# EAGLE design untitled (EAGLE 6.1)
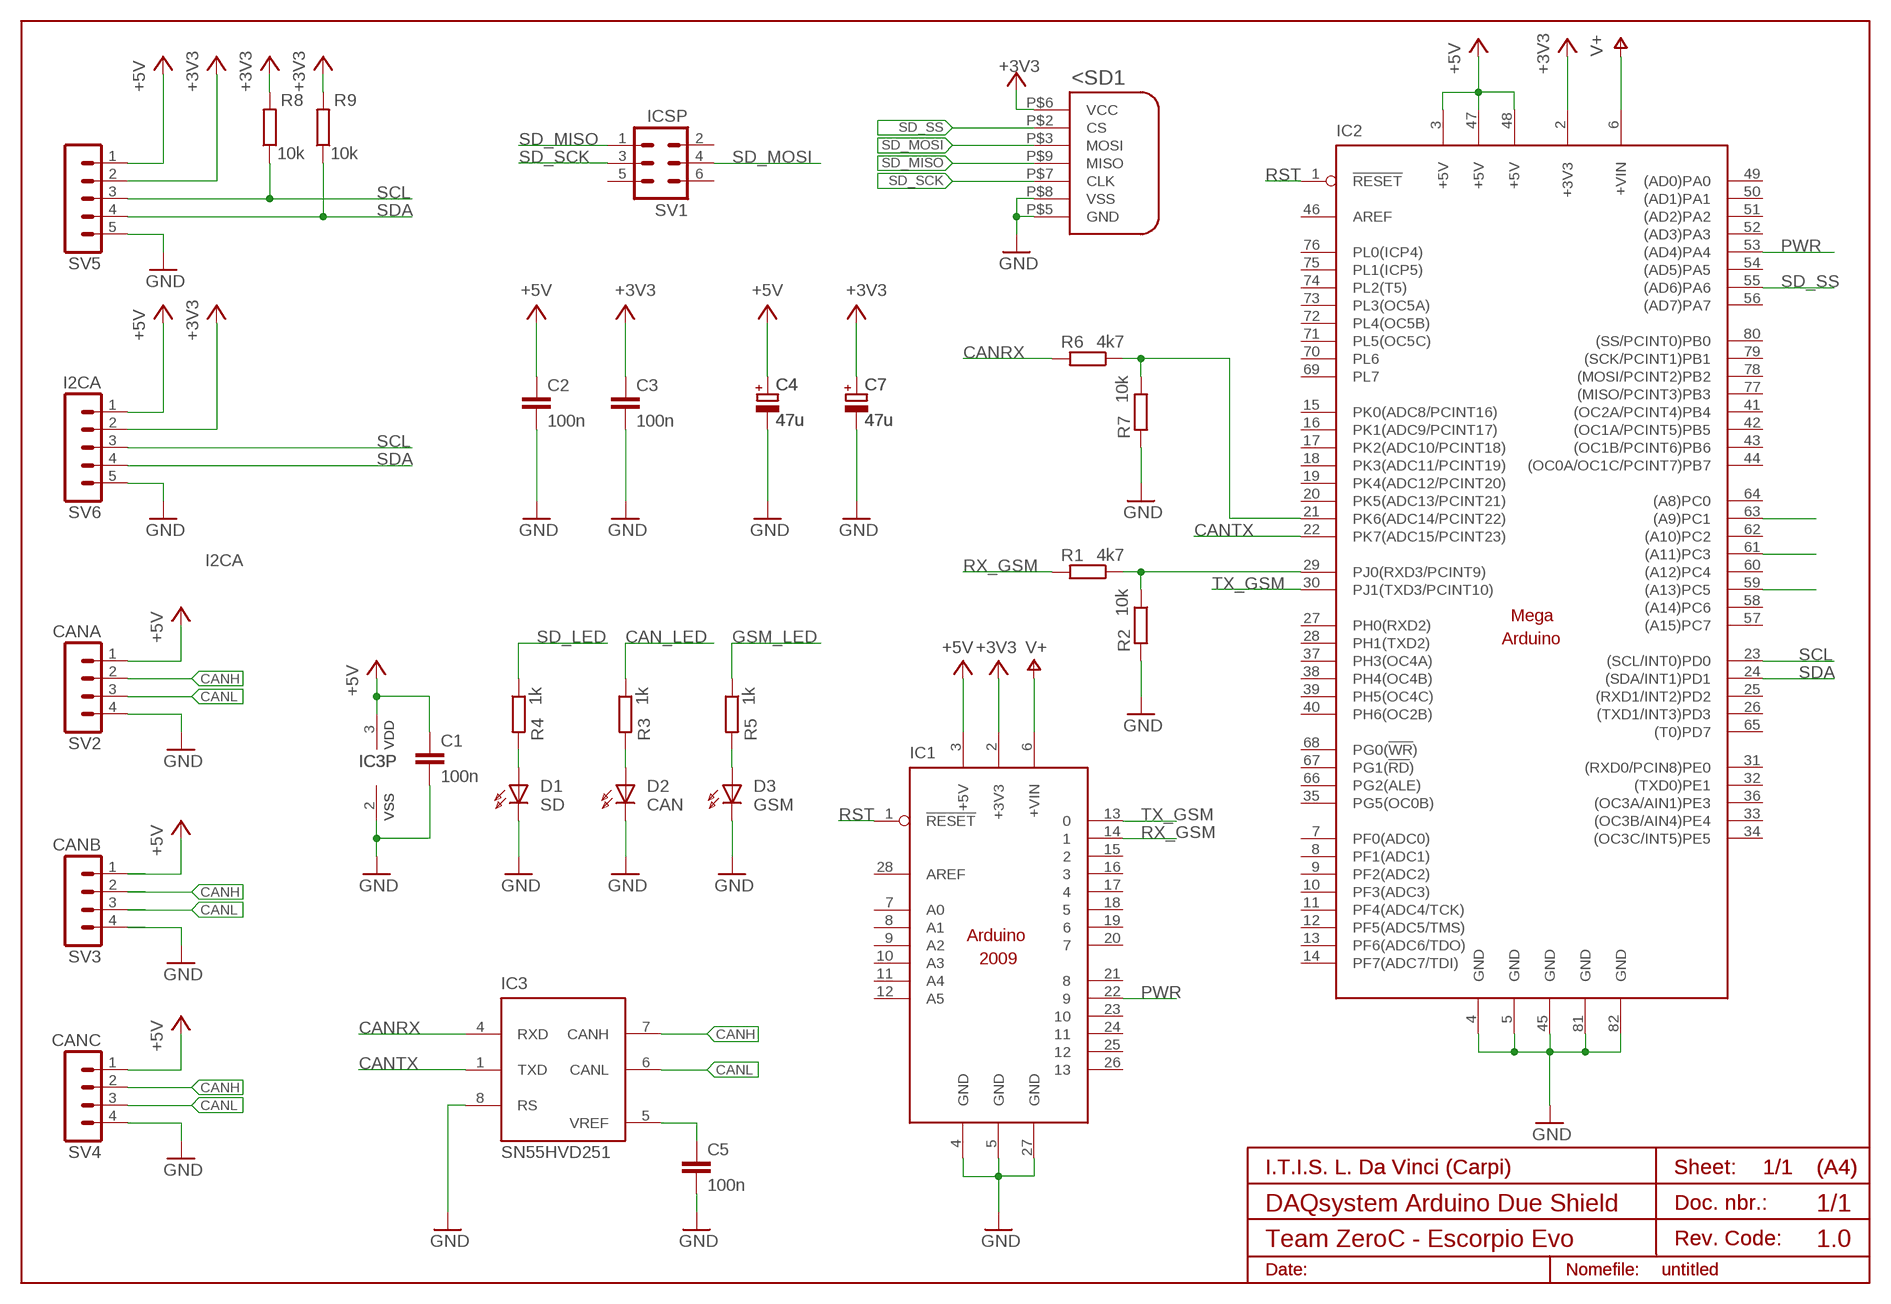
[diagram p0: schematic, sheet 1]

## Parts
C1  100n  C-EUC3225  [C3225]
C2  100n  C-EUC3225  [C3225]
C3  100n  C-EUC3225  [C3225]
C4  47u  C_POL_01  [E-01]
C5  100n  C-EUC3225  [C3225]
C7  47u  C_POL_01  [E-01]
D1  SD  LED5MM  [LED5MM]
D2  CAN  LED5MM  [LED5MM]
D3  GSM  LED5MM  [LED5MM]
IC1  ARDUINO2009_10  [ARDUINO2009]
IC2  MEGAARDUINO_1  [MEGA_ARDUINO]
IC3  SN55HVD251  [DIL8]
R1  4k7  R-EU_M1206  [M1206]
R2  10k  R-EU_M1206  [M1206]
R3  1k  R-EU_M1206  [M1206]
R4  1k  R-EU_M1206  [M1206]
R5  1k  R-EU_M1206  [M1206]
R6  4k7  R-EU_M1206  [M1206]
R7  10k  R-EU_M1206  [M1206]
R8  10k  R-EU_M1206  [M1206]
R9  10k  R-EU_M1206  [M1206]
SV1  ICSP  MA03-2  [MA03-2]
SV2  CANA  MA04-1  [MA04-1]
SV3  CANB  MA04-1  [MA04-1]
SV4  CANC  MA04-1  [MA04-1]
SV5  I2CA  MA05-1  [MA05-1]
SV6  I2CA  MA05-1  [MA05-1]
U$2  SD_CARD  [SD]

## Nets
+3V3: C3.1 C7.+ IC1.2(+3V3) IC2.2(+3V3) R8.2 R9.2 SV5.2 SV6.2 U$2.P$6(VCC)
+5V: C1.1 C2.1 C4.+ IC1.3(+5V) IC2.3(+5V) IC2.47(+5V) IC2.48(+5V) IC3.3(VDD) SV2.1 SV3.1 SV4.1 SV5.1 SV6.1
CAN_LED: IC2.63((A9)PC1) R3.1
CANH: IC3.7(CANH) SV2.2 SV3.2 SV4.2
CANL: IC3.6(CANL) SV2.3 SV3.3 SV4.3
CANRX: IC3.4(RXD) R6.2
CANTX: IC2.22(PK7(ADC15/PCINT23)) IC3.1(TXD)
GND: C1.2 C2.2 C3.2 C4.- C5.2 C7.- D1.K(C) D2.K(C) D3.K(C) IC1.4(GND) IC1.5(GND) IC1.27(GND) IC2.4(GND) IC2.5(GND) IC2.45(GND) IC2.81(GND) IC2.82(GND) IC3.2(VSS) IC3.8(RS) R2.2 R7.2 SV2.4 SV3.4 SV4.4 SV5.5 SV6.5 U$2.P$5(GND) U$2.P$8(VSS)
GSM_LED: IC2.61((A11)PC3) R5.1
N$1: IC2.21(PK6(ADC14/PCINT22)) R6.1 R7.1
N$4: IC2.29(PJ0(RXD3/PCINT9)) R1.1 R2.1
N$7: D2.A R3.2
N$9: D3.A R5.2
N$10: C5.1 IC3.5(VREF)
N$18: D1.A R4.2
PWR: IC1.22 IC2.53((AD4)PA4)
RST: IC1.1(!RESET) IC2.1(!RESET)
RX_GSM: IC1.14 R1.2
SCL: IC2.23((SCL/INT0)PD0) R8.1 SV5.3 SV6.3
SD_LED: IC2.59((A13)PC5) R4.1
SD_MISO: SV1.1 U$2.P$9(MISO)
SD_MOSI: SV1.4 U$2.P$3(MOSI)
SD_SCK: SV1.3 U$2.P$7(CLK)
SD_SS: IC2.55((AD6)PA6) U$2.P$2(CS)
SDA: IC2.24((SDA/INT1)PD1) R9.1 SV5.4 SV6.4
TX_GSM: IC1.13 IC2.30(PJ1(TXD3/PCINT10))
V+: IC1.6(+VIN) IC2.6(+VIN)
Unconnected: IC1.7(A0) IC1.8(A1) IC1.9(A2) IC1.10(A3) IC1.11(A4) IC1.12(A5) IC1.15 IC1.16 IC1.17 IC1.18 IC1.19 IC1.20 IC1.21 IC1.23 IC1.24 IC1.25 IC1.26 IC1.28(AREF) IC2.7(PF0(ADC0)) IC2.8(PF1(ADC1)) IC2.9(PF2(ADC2)) IC2.10(PF3(ADC3)) IC2.11(PF4(ADC4/TCK)) IC2.12(PF5(ADC5/TMS)) IC2.13(PF6(ADC6/TDO)) IC2.14(PF7(ADC7/TDI)) IC2.15(PK0(ADC8/PCINT16)) IC2.16(PK1(ADC9/PCINT17)) IC2.17(PK2(ADC10/PCINT18)) IC2.18(PK3(ADC11/PCINT19)) IC2.19(PK4(ADC12/PCINT20)) IC2.20(PK5(ADC13/PCINT21)) IC2.25((RXD1/INT2)PD2) IC2.26((TXD1/INT3)PD3) IC2.27(PH0(RXD2)) IC2.28(PH1(TXD2)) IC2.31((RXD0/PCIN8)PE0) IC2.32((TXD0)PE1) IC2.33((OC3B/AIN4)PE4) IC2.34((OC3C/INT5)PE5) IC2.35(PG5(OC0B)) IC2.36((OC3A/AIN1)PE3) IC2.37(PH3(OC4A)) IC2.38(PH4(OC4B)) IC2.39(PH5(OC4C)) IC2.40(PH6(OC2B)) IC2.41((OC2A/PCINT4)PB4) IC2.42((OC1A/PCINT5)PB5) IC2.43((OC1B/PCINT6)PB6) IC2.44((OC0A/OC1C/PCINT7)PB7) IC2.46(AREF) IC2.49((AD0)PA0) IC2.50((AD1)PA1) IC2.51((AD2)PA2) IC2.52((AD3)PA3) IC2.54((AD5)PA5) IC2.56((AD7)PA7) IC2.57((A15)PC7) IC2.58((A14)PC6) IC2.60((A12)PC4) IC2.62((A10)PC2) IC2.64((A8)PC0) IC2.65((T0)PD7) IC2.66(PG2(ALE)) IC2.67(PG1(!RD!)) IC2.68(PG0(!WR!)) IC2.69(PL7) IC2.70(PL6) IC2.71(PL5(OC5C)) IC2.72(PL4(OC5B)) IC2.73(PL3(OC5A)) IC2.74(PL2(T5)) IC2.75(PL1(ICP5)) IC2.76(PL0(ICP4)) IC2.77((MISO/PCINT3)PB3) IC2.78((MOSI/PCINT2)PB2) IC2.79((SCK/PCINT1)PB1) IC2.80((SS/PCINT0)PB0) SV1.2 SV1.5 SV1.6

## Notes on the sheet
- DAQsystem Arduino Due Shield | 1/1
- Team ZeroC - Escorpio Evo | 1.0

## Library data of the parts
C1-C3 C5 = rcl:C-EU: CAPACITOR, European symbol
C4 C7 = ITIVINCI:C_POL: condensatore elettrolitico
D1-D3 = ITIVINCI:LED5MM: LED 5 mm, round
IC1 = arduino:ARDUINO2009_1: The Arduino Duemilanove ("2009") is a microcontroller board based on the ATmega168 or ATmega328. - 14 digital input/output pins (of which 6 can be used as PWM outputs) - 6 analog inputs, a 16 MHz crystal oscillator - USB connection - power jack - ISP header - reset button It contains everything needed to support the microcontroller; simply connect it to a computer with a USB cable or power it with a AC-to-DC adapter or battery to get started http://arduino.cc/en/Main/ArduinoBoardDuemilanove
IC2 = arduino:MEGAARDUINO_1: The Arduino Mega is a microcontroller board based on the ATmega1280. - 54 digital input/output pins (of which 14 can be used as PWM outputs) - 16 analog inputs - 4 UARTs (hardware serial ports) - 16 MHz crystal oscillator - USB connection - power jack - ICSP header - reset button It contains everything needed to support the microcontroller; simply connect it to a computer with a USB cable or power it with a AC-to-DC adapter or battery to get started. The Mega is compatible with most shields designed for the Arduino Duemilanove or Diecimila. http://arduino.cc/en/Main/ArduinoBoardMega
IC3 = microchip_can:SN55HVD251
R1-R9 = rcl:R-EU_: RESISTOR, European symbol
SV1 = con-lstb:MA03-2: PIN HEADER; OC_FARNELL: unknown; OC_NEWARK: unknown
SV2-SV4 = con-lstb:MA04-1: PIN HEADER; OC_FARNELL: unknown; OC_NEWARK: unknown
SV5 SV6 = con-lstb:MA05-1: PIN HEADER; OC_FARNELL: unknown; OC_NEWARK: unknown
U$2 = ITIVINCI:SD_CARD

## Net classes
0 default: width 0.254 mm, clearance 0.254 mm

## Board
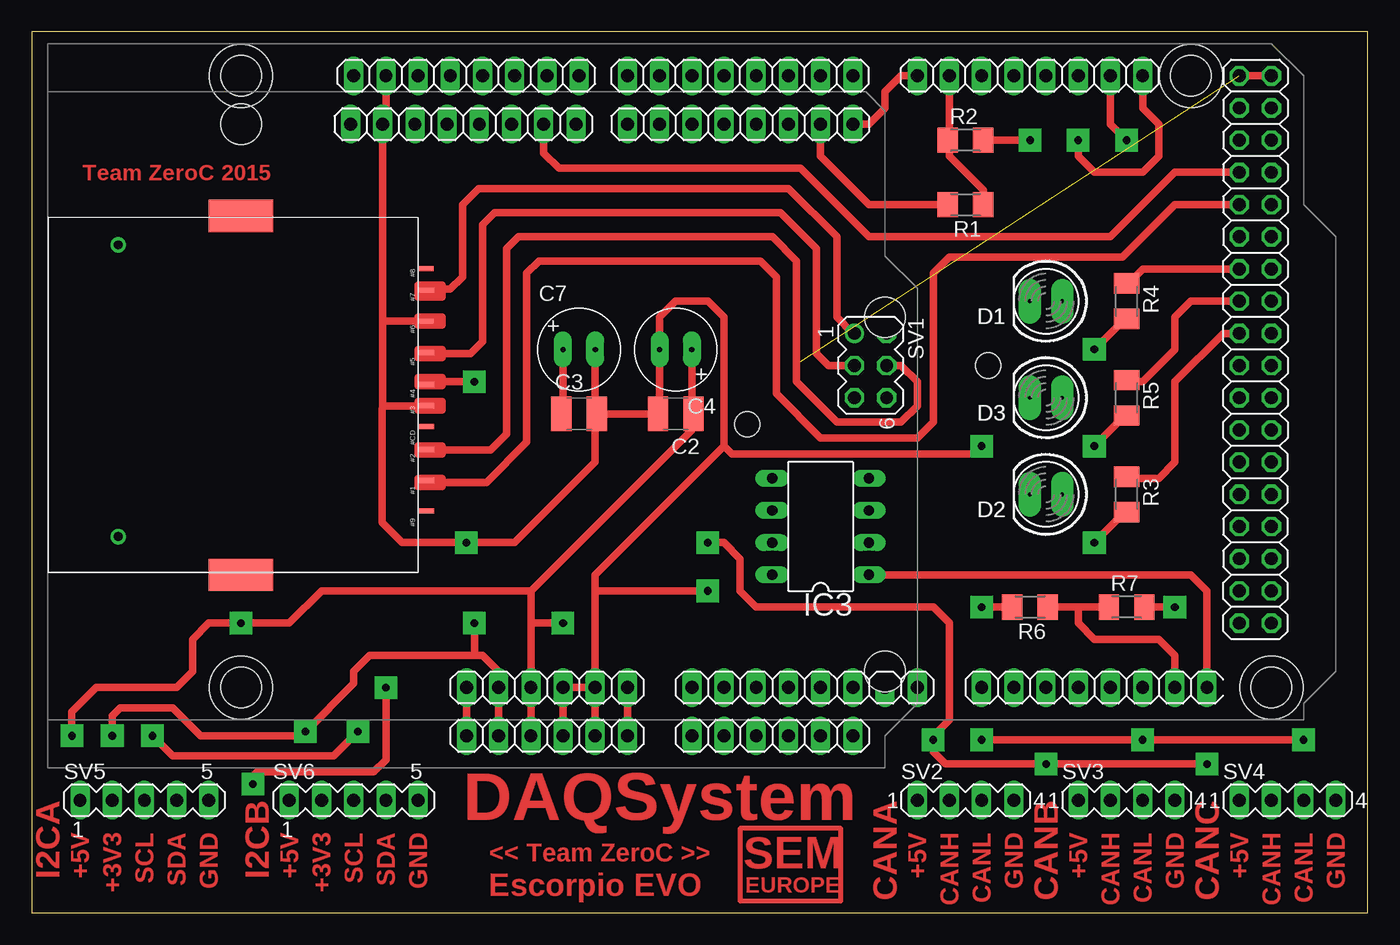
[diagram p1: board, top side]
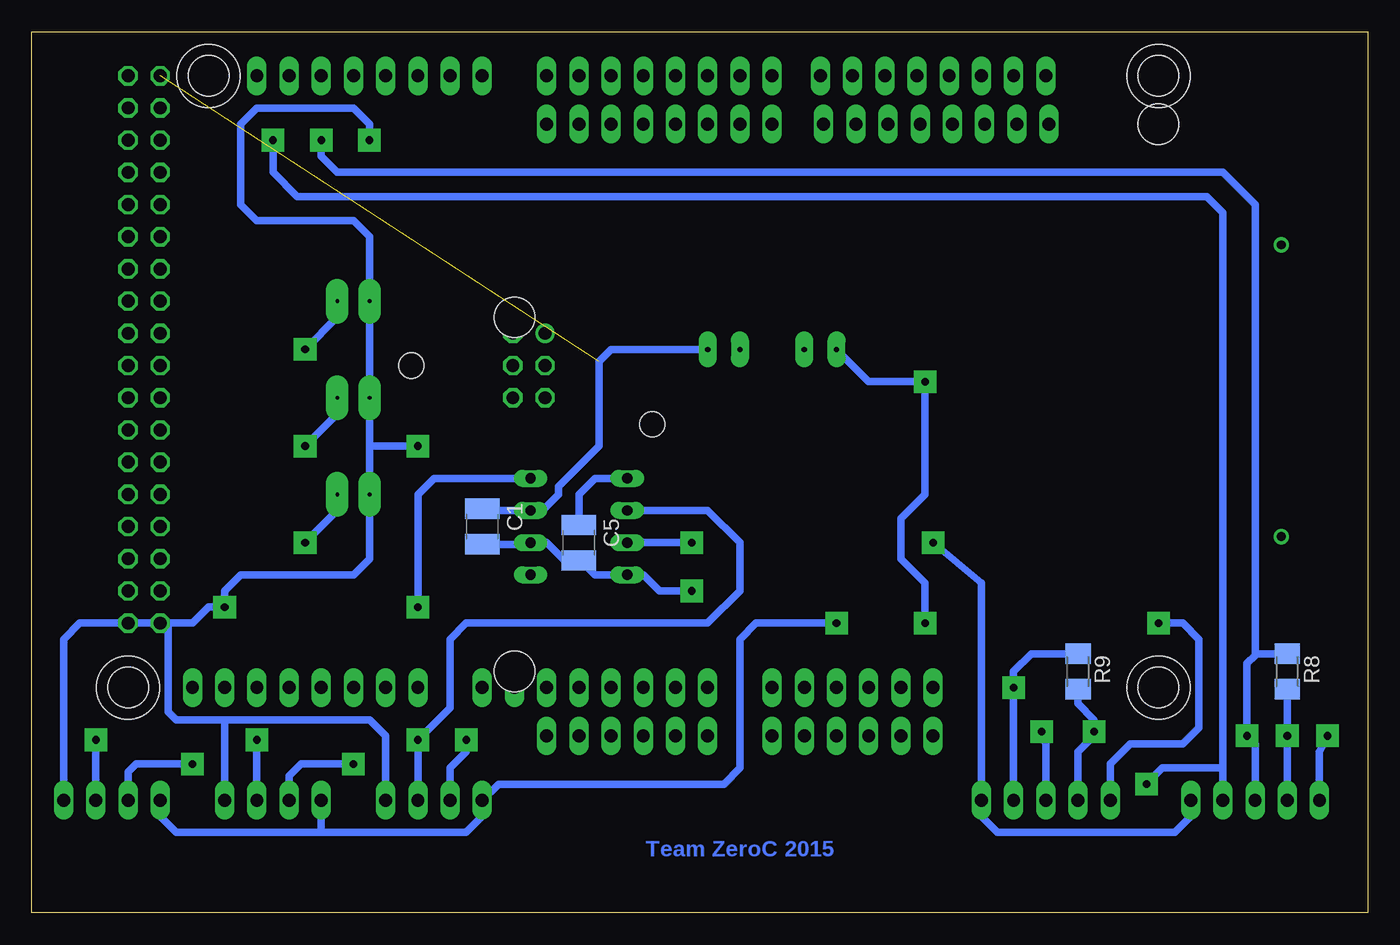
[diagram p2: board, bottom side, seen from below]

Size 105.39 x 69.52 mm. Coordinates in mm from the lower left corner, seen from the top.
Outline: 0,0 105.39,0 105.39,69.52 0,69.52 0,0
Copper layers (1*16): Top 0.035mm / dielectric 1.5mm / Bottom 0.035mm
Design rules: minimum track width 10mil, minimum drill 24mil, track to track 8mil, track to pad 8mil, pad to pad 8mil, via to via 8mil, smd to smd 8mil, copper to edge 40mil, drill to drill 8mil, minimum pad ring 10mil, minimum via ring 8mil, stop-mask expansion 4mil, vias tented up to drill 0mil, thermal gap 10mil
Holes 5 mm at 16.51,66.04 91.44,66.04 97.79,17.78 16.51,17.78

### Footprints (pad centres in the part's own frame; a part is rotated, then mirrored left to right if it is on the bottom)
C3225 = smd 1.6 x 2.7: 1 -1.4,0; 2 1.4,0
E-01 = drill 0.406 pad 1.422 long: + -1.27,0; - 1.27,0
LED5MM = drill 0.305 pad 1.778 long: A -1.27,0; K 1.27,0
ARDUINO2009 = drill 1.016 long: 1 33.02,2.54; 2 35.56,2.54; 3 38.1,2.54; 4 40.64,2.54; 5 43.18,2.54; 6 45.72,2.54; 7 50.8,2.54; 8 53.34,2.54; 9 55.88,2.54; 10 58.42,2.54; 11 60.96,2.54; 12 63.5,2.54; 13 63.5,50.8; 14 60.96,50.8; 15 58.42,50.8; 16 55.88,50.8; 17 53.34,50.8; 18 50.8,50.8; 19 48.26,50.8; 20 45.72,50.8; 21 41.656,50.8; 22 39.116,50.8; 23 36.576,50.8; 24 34.036,50.8; 25 31.496,50.8; 26 28.956,50.8; 27 26.416,50.8; 28 23.876,50.8 | hole 3.2: 15.24,50.8; 66.04,35.56; 66.04,7.62 | hole 2: 55.17,27.114
MEGA_ARDUINO = drill 1.016 long: 1 33.02,2.54; 2 35.56,2.54; 3 38.1,2.54; 4 40.64,2.54; 5 43.18,2.54; 6 45.72,2.54; 7 50.8,2.54; 8 53.34,2.54; 9 55.88,2.54; 10 58.42,2.54; 11 60.96,2.54; 12 63.5,2.54; 13 66.04,2.54; 14 68.58,2.54; 15 73.66,2.54; 16 76.2,2.54; 17 78.74,2.54; 18 81.28,2.54; 19 83.82,2.54; 20 86.36,2.54; 21 88.9,2.54; 22 91.44,2.54; 23 86.36,50.8; 24 83.82,50.8; 25 81.28,50.8; 26 78.74,50.8; 27 76.2,50.8; 28 73.66,50.8; 29 71.12,50.8; 30 68.58,50.8; 31 63.5,50.8; 32 60.96,50.8; 33 58.42,50.8; 34 55.88,50.8; 35 53.34,50.8; 36 50.8,50.8; 37 48.26,50.8; 38 45.72,50.8; 39 41.91,50.8; 40 39.37,50.8; 41 36.83,50.8; 42 34.29,50.8; 43 31.75,50.8; 44 29.21,50.8; 45 26.67,50.8; 46 24.13,50.8 | drill 1.016 octagon: 47 93.98,50.8; 48 96.52,50.8; 49 93.98,48.26; 50 96.52,48.26; 51 93.98,45.72; 52 96.52,45.72; 53 93.98,43.18; 54 96.52,43.18; 55 93.98,40.64; 56 96.52,40.64; 57 93.98,38.1; 58 96.52,38.1; 59 93.98,35.56; 60 96.52,35.56; 61 93.98,33.02; 62 96.52,33.02; 63 93.98,30.48; 64 96.52,30.48; 65 93.98,27.94; 66 96.52,27.94; 67 93.98,25.4; 68 96.52,25.4; 69 93.98,22.86; 70 96.52,22.86; 71 93.98,20.32; 72 96.52,20.32; 73 93.98,17.78; 74 96.52,17.78; 75 93.98,15.24; 76 96.52,15.24; 77 93.98,12.7; 78 96.52,12.7; 79 93.98,10.16; 80 96.52,10.16; 81 93.98,7.62; 82 96.52,7.62 | hole 3.2: 15.24,50.8; 15.24,2.54; 90.17,50.8; 96.52,2.54 | hole 2: 74.168,27.94
DIL8 = drill 0.813 long: 1 -3.81,-3.81; 2 -1.27,-3.81; 3 1.27,-3.81; 4 3.81,-3.81; 5 3.81,3.81; 6 1.27,3.81; 7 -1.27,3.81; 8 -3.81,3.81
M1206 = smd 1.6 x 2: 1 -1.4,0; 2 1.4,0
MA03-2 = drill 1.016: 1 -2.54,-1.27 | drill 1.016 octagon: 2 -2.54,1.27; 3 0,-1.27; 4 0,1.27; 5 2.54,-1.27; 6 2.54,1.27
MA04-1 = drill 1.016 long: 1 -3.81,0; 2 -1.27,0; 3 1.27,0; 4 3.81,0
MA05-1 = drill 1.016 long: 1 -5.08,0; 2 -2.54,0; 3 0,0; 4 2.54,0; 5 5.08,0
SD = smd 0.4 x 1.25: P$1 10.208,15.859; P$2 7.779,15.859; P$3 5.35,15.859; P$4 3.556,15.859; P$5 1.905,15.859; P$6 0.206,15.859; P$7 -2.302,15.859; P$8 -4.794,15.843; P$9 -7.239,15.859; P$10 -8.922,15.843 | drill 0.7 pad 1.016: P$11 -10.795,-8.414; P$12 12.224,-8.414 | smd 2.54 x 5.08: P$13 -13.081,1.27; P$14 15.24,1.27

### Placement (x,y rotation side)
C1  69.85,30.48 270 bottom
C2  50.8,39.37 180 top
C3  43.18,39.37 0 top
C4  50.8,44.45 180 top
C5  62.23,29.21 270 bottom
C7  43.18,44.45 0 top
D1  80.01,48.26 180 top
D2  80.01,33.02 180 top
D3  80.01,40.64 180 top
IC1  1.27,11.43 0 top
IC2  1.27,15.24 0 top
IC3  62.23,30.48 90 top
R1  73.66,55.88 180 top
R2  73.66,60.96 0 top
R3  86.36,33.02 270 top
R4  86.36,48.26 270 top
R5  86.36,40.64 270 top
R6  78.74,24.13 180 top
R7  86.36,24.13 0 top
R8  6.35,19.05 270 bottom
R9  22.86,19.05 270 bottom
SV1  66.17,43.18 270 top
SV2  73.66,8.89 0 top
SV3  86.36,8.89 0 top
SV4  99.06,8.89 0 top
SV5  8.89,8.89 0 top
SV6  25.4,8.89 0 top
U$2  15.24,41.91 270 top

### Tracks (layer width: path | path; a pad name or v marks a point on that pad's centre or on a via)
+3V3  (via drill 0.6 pad 1.78)
  Top 0.61: C7.+ 41.91,39.5 C3.1 | U$2.P$6 30.59,41.7 | 30.59,41.7 30.48,41.59 | 30.48,41.59 32.38,41.59 32.38,42.23 30.48,42.23 30.48,41.59 | 30.59,41.7 30.8,41.91 v34.92,41.91 | IC1.2 IC2.2 36.83,19.05 35.56,20.32 34.92,20.32 | 34.92,20.32 26.67,20.32 25.4,19.05 25.4,18.1 v21.59,14.29 21.27,13.97 13.34,13.97 11.11,16.19 6.98,16.19 6.35,15.56 v6.35,13.97 | 34.92,20.32 v34.92,22.86
  Bottom 0.61: C7.+ 39.37,41.91 v34.92,41.91 34.92,33.02 36.83,31.12 36.83,27.94 34.92,26.03 v34.92,22.86 | R9.2 22.86,16.51 21.59,15.24 v21.59,14.29 21.59,13.97 22.86,12.7 SV6.2 | R8.2 v6.35,13.97 SV5.2
+5V  (via drill 0.6 pad 1.78)  (1 unrouted)
  Top 0.61: C4.+ 52.07,39.5 C2.1 52.07,39.37 52.07,38.1 39.37,25.4 | IC1.3 IC2.3 39.37,22.86 | 39.37,25.4 22.86,25.4 20.32,22.86 v16.51,22.86 13.97,22.86 12.7,21.59 12.7,19.05 11.43,17.78 5.08,17.78 3.18,15.88 v3.18,13.97 | 39.37,25.4 39.37,22.86 | v41.91,22.86 39.37,22.86 | IC2.47 IC2.48
  Bottom 0.61: 82.55,6.35 71.12,6.35 69.85,7.62 SV2.1 68.58,10.16 50.8,10.16 49.53,11.43 49.53,21.59 48.26,22.86 v41.91,22.86 | 82.55,6.35 93.98,6.35 95.25,7.62 SV4.1 | SV3.1 82.55,6.35 | SV6.1 20.32,11.75 18.73,13.34 14.6,13.34 13.34,14.61 13.34,21.59 14.6,22.86 v16.51,22.86 | C1.1 69.72,31.75 IC3.3 65.09,31.75 63.82,33.02 63.82,33.66 60.64,36.83 60.64,43.5 59.69,44.45 C4.+ | SV5.1 3.81,12.7 v3.18,13.97
CAN_LED
  Top 0.61: IC2.63 93.98,45.72 90.17,41.91 90.17,35.56 88.9,34.29 86.49,34.29 R3.1
CANH  (via drill 0.6 pad 1.78)
  Top 0.61: v53.34,29.21 54.61,29.21 55.88,27.94 55.88,25.4 57.15,24.13 71.12,24.13 72.39,22.86 72.39,15.24 71.12,13.97 v71.12,13.65 71.12,12.7 72.07,11.75 v80.01,11.75 v92.71,11.75
  Bottom 0.61: IC3.7 v53.34,29.21 | SV2.2 72.39,11.43 71.12,12.7 v71.12,13.65 | SV3.2 85.09,10.79 84.14,11.75 v80.01,11.75 | SV4.2 97.79,11.11 97.16,11.75 v92.71,11.75
CANL  (via drill 0.6 pad 1.78)
  Top 0.61: v100.33,13.65 v87.63,13.65 v74.93,13.65
  Bottom 0.61: IC3.6 52.07,31.75 49.53,29.21 49.53,25.4 52.07,22.86 71.12,22.86 72.39,21.59 72.39,16.51 72.39,16.19 v74.93,13.65 SV2.3 | SV3.3 v87.63,13.65 | SV4.3 v100.33,13.65
CANRX  (via drill 0.6 pad 1.78)
  Top 0.61: R6.2 v74.93,24.13
  Bottom 0.61: v74.93,24.13 74.93,33.02 73.66,34.29 IC3.4
CANTX
  Top 0.61: IC2.22 92.71,25.4 91.44,26.67 IC3.1
GND  (via drill 0.6 pad 1.78)
  Top 0.61: IC1.27 27.69,46.67 | 27.69,46.67 27.69,39.94 | 30.48,40.01 27.94,40.01 27.69,39.94 | U$2.P$5 32.38,40.01 | 32.38,40.01 32.38,40.32 30.48,40.32 30.48,40.01 | 30.48,40.01 30.48,39.69 32.38,39.69 32.38,40.01 | 32.38,40.01 32.07,39.69 31.42,39.69 U$2.P$5 | 30.48,40.01 30.8,39.69 | U$2.P$8 30.77,46.7 30.48,46.99 32.38,46.99 32.38,46.35 31.75,46.35 | 30.48,46.35 31.75,46.35 | 31.75,46.35 32.07,46.67 27.69,46.67 | R7.2 v90.17,24.13 | C7.- 44.45,39.37 C3.2 | C4.- 49.53,39.5 C2.2 | C3.2 C2.2 | C2.2 49.53,39.37 C4.- | U$2.P$5 30.48,40.01 | 27.69,39.94 27.62,39.69 27.62,30.8 29.21,29.21 v34.29,29.21 38.1,29.21 44.45,35.56 44.45,39.24 C3.2 | IC1.4 IC2.4 IC2.5 | IC2.5 IC1.5 | IC2.45 27.94,62.55 27.62,62.23 IC1.27 | 44.45,25.4 44.45,26.67 54.61,36.83 | 44.45,25.4 IC2.5 | C4.- 49.53,46.99 50.8,48.26 53.34,48.26 54.61,46.99 54.61,36.83 | v53.34,25.4 44.45,25.4 | R2.2 v78.74,60.96 | IC1.27 27.94,62.23 | v74.93,36.83 74.29,36.2 55.24,36.2 54.61,36.83
  Bottom 0.61: SV5.5 13.97,7.62 15.24,6.35 29.21,6.35 30.48,7.62 SV6.5 30.48,26.03 v34.29,29.21 | SV4.4 102.87,21.59 101.6,22.86 IC2.82 IC2.81 94.62,22.86 | D3.K D1.K | D1.K 78.74,36.83 | 94.62,22.86 92.71,22.86 91.44,24.13 v90.17,24.13 90.17,25.4 88.9,26.67 80.01,26.67 78.74,27.94 D2.K 78.74,36.83 | C1.2 66.17,29.08 IC3.2 64.77,29.21 63.37,27.81 C5.2 62.23,27.94 60.96,26.67 IC3.8 57.15,26.67 55.88,25.4 v53.34,25.4 | v78.74,60.96 78.74,62.23 80.01,63.5 87.63,63.5 88.9,62.23 88.9,55.88 87.63,54.61 80.01,54.61 78.74,53.34 D1.K | SV2.4 77.47,13.97 78.74,15.24 90.17,15.24 | 90.17,15.24 93.98,15.24 94.62,15.88 94.62,22.86 | SV3.4 90.17,15.24 | 78.74,36.83 v74.93,36.83
GSM_LED
  Top 0.61: IC2.61 91.44,48.26 90.17,46.99 90.17,44.45 87.63,41.91 86.49,41.91 R5.1
N$1
  Top 0.61: IC2.21 90.17,20.32 88.9,21.59 83.82,21.59 82.55,22.86 82.55,24.13 | 82.55,24.13 R6.1 80.01,24.13 | 82.55,24.13 R7.1 85.09,24.13
N$4
  Top 0.61: IC2.29 72.39,61.09 R2.1 72.39,60.83 72.39,59.69 75.06,57.02 R1.1
N$6
  Top 0.406: 63.82,6.67 55.88,6.67 55.88,0.95 63.82,0.95 63.82,6.67
N$7  (via drill 0.6 pad 1.78)
  Top 0.61: R3.2 86.23,31.62 v83.82,29.21
  Bottom 0.61: v83.82,29.21 81.28,31.75 D2.A
N$8  (via drill 0.6 pad 1.78)
  other vias: 16.51,17.78
N$9  (via drill 0.6 pad 1.78)
  Top 0.61: R5.2 86.23,39.24 v83.82,36.83
  Bottom 0.61: v83.82,36.83 81.28,39.37 D3.A
N$10
  Bottom 0.61: IC3.5 60.96,34.29 62.23,33.02 C5.1
N$11  (via drill 0.6 pad 1.78)
  other vias: 97.79,17.78
N$12  (via drill 0.6 pad 1.78)
  other vias: 91.44,66.04
N$13  (via drill 0.6 pad 1.78)
  other vias: 16.51,66.04
N$18  (via drill 0.6 pad 1.78)
  Top 0.61: R4.2 86.23,46.86 v83.82,44.45
  Bottom 0.61: v83.82,44.45 81.28,46.99 D1.A
PWR
  Top 0.61: IC1.22 40.39,59.94 41.59,58.74 60.64,58.74 66.04,53.34 85.09,53.34 90.17,58.42 IC2.53
RST
  Top 0.61: IC1.1 IC2.1
RX_GSM
  Top 0.61: IC1.14 62.23,59.69 66.04,55.88 R1.2
SCL  (via drill 0.6 pad 1.78)
  Top 0.61: IC2.23 87.63,63.5 88.9,62.23 88.9,59.69 87.63,58.42 83.82,58.42 82.55,59.69 v82.55,60.96 | v25.72,14.29 23.81,12.38 11.11,12.38 v9.52,13.97
  Bottom 0.61: SV6.3 25.4,13.34 v25.72,14.29 | v82.55,60.96 82.55,59.69 81.28,58.42 11.43,58.42 8.89,55.88 8.89,20.32 | R8.1 8.76,20.45 8.89,20.32 | SV5.3 8.89,13.34 v9.52,13.97 9.52,19.68 8.89,20.32
SD_LED
  Top 0.61: IC2.59 87.63,50.8 86.36,49.53 R4.1
SD_MISO
  Top 0.61: SV1.1 64.77,45.72 63.5,46.99 63.5,53.34 59.69,57.15 35.24,57.15 33.97,55.88 33.97,50.16 33.02,49.21 32.38,49.21 | 32.38,49.21 32.38,49.53 30.72,49.53 | 30.48,49.53 30.48,48.58 32.38,48.58 32.38,49.21 | 32.38,49.21 32.07,48.89 31.75,49.21 31.43,48.89 31.12,48.89 30.48,49.53 | 30.48,49.53 30.72,49.53 | 30.72,49.53 U$2.P$9
SD_MOSI
  Top 0.61: SV1.4 68.58,43.18 69.85,41.91 69.85,40.01 68.58,38.73 63.5,38.73 60.32,41.91 60.32,51.44 58.42,53.34 38.42,53.34 37.46,52.39 37.46,37.78 36.2,36.51 32.38,36.51 | 32.38,36.51 32.38,36.83 30.48,36.83 30.48,36.2 32.38,36.2 32.38,36.51 | 32.38,36.51 31.15,36.51 U$2.P$3
SD_SCK
  Top 0.61: SV1.3 62.87,43.18 61.91,44.13 61.91,52.39 59.05,55.25 36.51,55.25 35.56,54.29 35.56,45.09 34.61,44.13 32.38,44.13 | 32.38,44.13 32.38,44.45 31.75,44.45 | 31.75,44.45 30.48,44.45 30.48,43.81 32.38,43.81 32.38,44.13 | 32.38,44.13 31.43,44.13 | 30.8,44.13 31.12,44.13 31.43,44.13 | U$2.P$7 31.51,44.21 | 31.51,44.21 31.75,44.45 | 31.43,44.13 31.51,44.21
SD_SS
  Top 0.61: U$2.P$2 30.64,34.13 | 30.64,34.13 30.48,34.29 | 30.48,34.29 32.38,34.29 32.38,33.66 30.48,33.66 30.48,34.29 | 30.64,34.13 30.8,33.97 35.88,33.97 39.05,37.15 39.05,50.48 40.01,51.44 57.47,51.44 58.74,50.16 58.74,40.96 62.23,37.46 69.85,37.46 71.12,38.73 71.12,50.48 72.39,51.75 86.04,51.75 90.17,55.88 IC2.55
SDA  (via drill 0.6 pad 1.78)
  Top 0.61: IC2.24 85.09,62.23 v86.36,60.96 | v17.46,10.16 17.46,10.79 17.78,11.11 26.99,11.11 27.94,12.06 v27.94,17.78
  Bottom 0.61: v86.36,60.96 86.36,58.42 84.46,56.52 12.7,56.52 11.43,55.25 11.43,11.43 | v17.46,10.16 16.19,11.43 11.43,11.43 | SV6.4 v27.94,17.78 27.94,19.05 26.54,20.45 R9.1 | 11.43,11.43 SV5.4
TX_GSM
  Top 0.61: IC1.13 66.04,62.23 67.31,63.5 67.31,64.77 68.58,66.04 IC2.30
V+
  Top 0.61: IC2.6 IC1.6

### Text on the board
Top: Team ZeroC 2015 | I2CA | I2CB | DAQSystem | CANA | CANB | CANC | +5V | +3V3 | SCL | SDA | GND | +5V | +3V3 | SCL | SDA | GND | +5V | CANH | CANL | GND | +5V | CANH | CANL | GND | +5V | CANH | CANL | GND | << Team ZeroC >> | SEM | Escorpio EVO | EUROPE
Bottom: Team ZeroC 2015